# EAGLE design SMDStylophone (EAGLE 5.11)
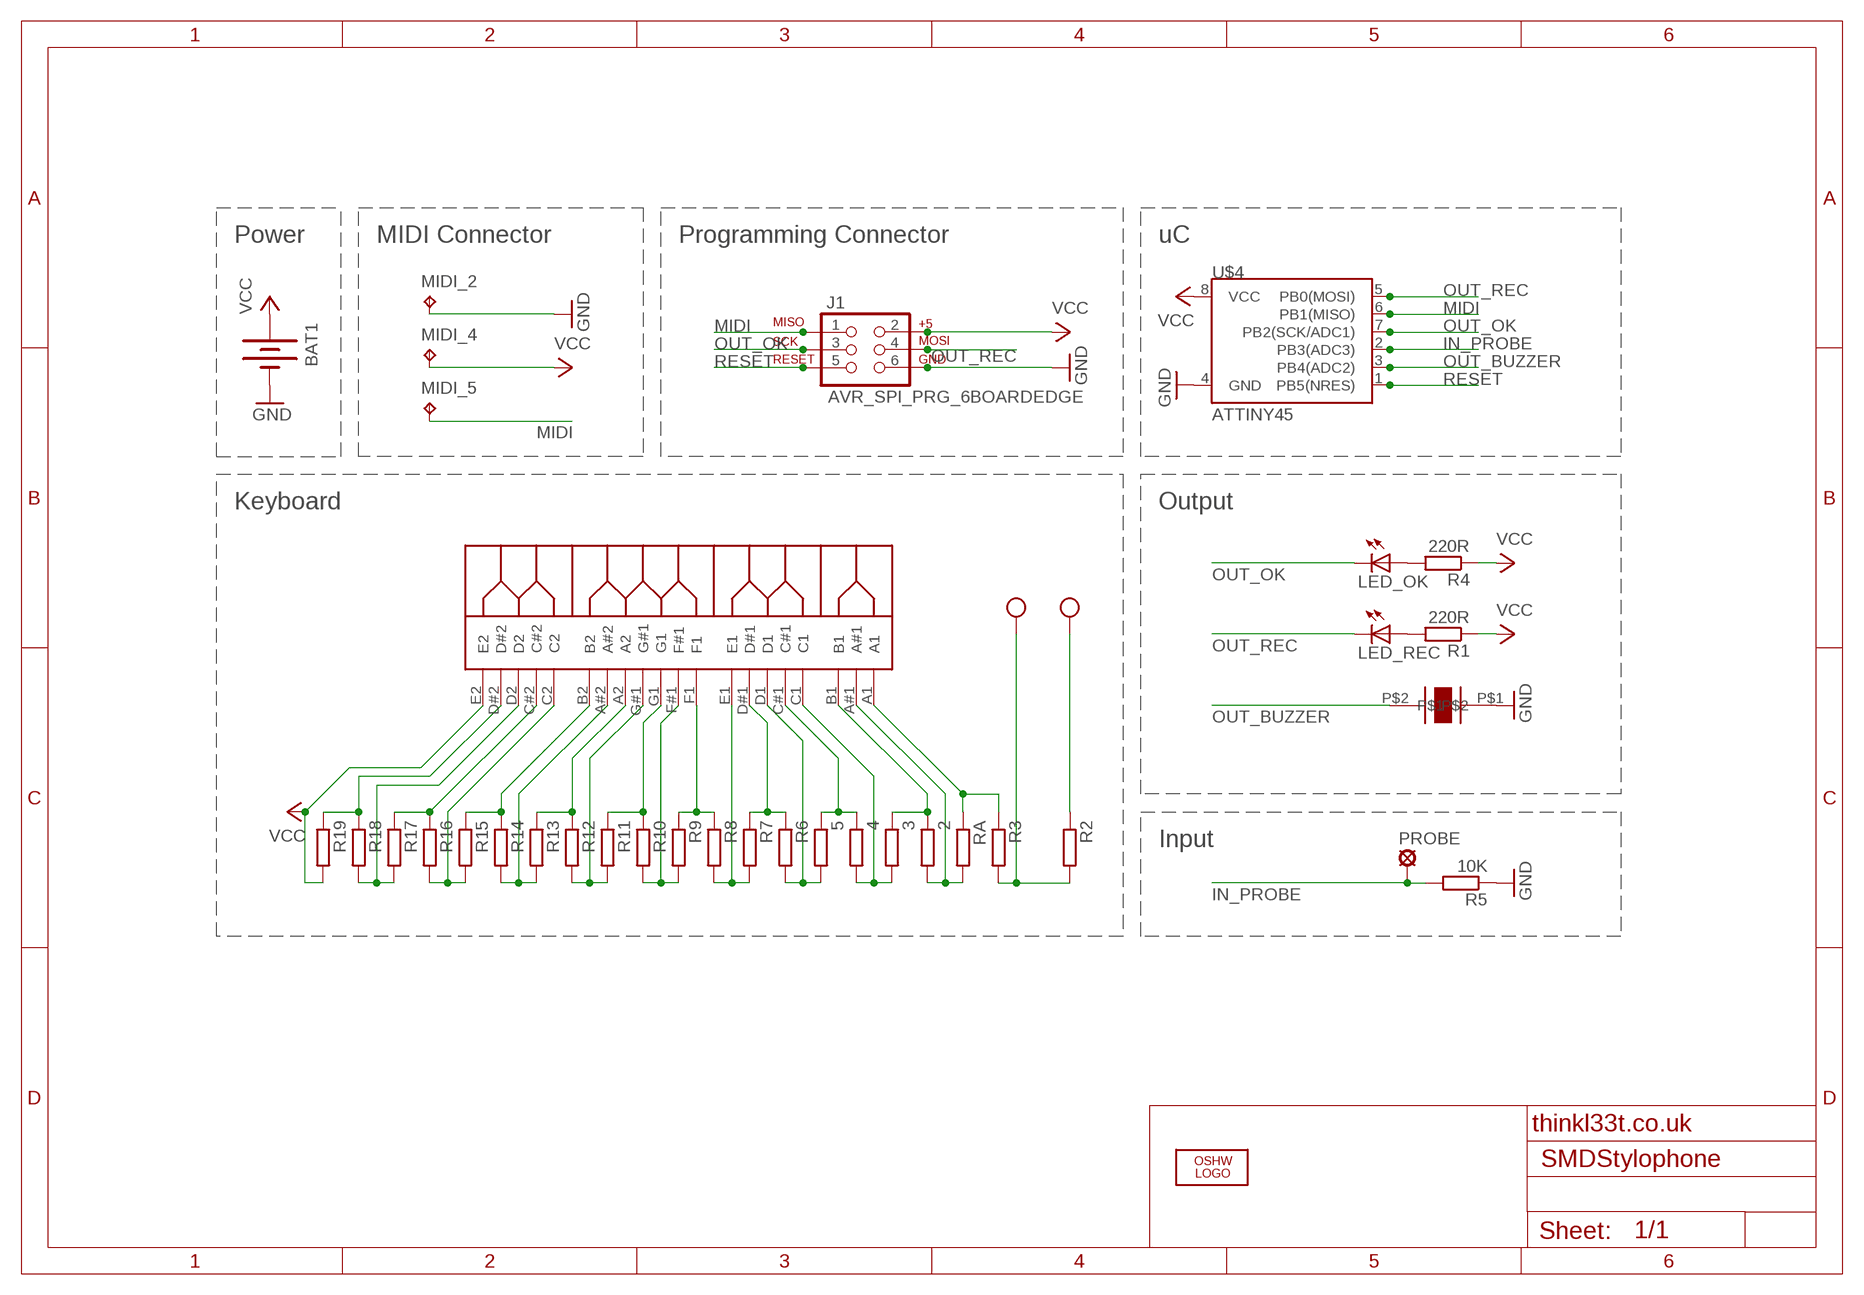
[diagram p0: schematic, sheet 1]

## Parts
2  R-EU_R0805  [R0805]
3  R-EU_R0805  [R0805]
4  R-EU_R0805  [R0805]
5  R-EU_R0805  [R0805]
BAT1  BATTERY20SMD  [BATTCON_20MM]
J1  AVR_SPI_PRG_6BOARDEDGE  [2X3_BOARDEDGE]
LED_OK  LED1206  [LED-1206]
LED_REC  LED1206  [LED-1206]
LOGO1  OSHW_LOGO_6MILX0200-NT  [OSHW_6X200_NOTEXT]
MIDI_2  TPTP20R  [TP20R]
MIDI_4  TPTP20R  [TP20R]
MIDI_5  TPTP20R  [TP20R]
PROBE  LSP10  [LSP10]
R1  220R  R-EU_R0805  [R0805]
R2  R-EU_R0805  [R0805]
R3  R-EU_R0805  [R0805]
R4  220R  R-EU_R0805  [R0805]
R5  10K  R-EU_R0805  [R0805]
R6  R-EU_R0805  [R0805]
R7  R-EU_R0805  [R0805]
R8  R-EU_R0805  [R0805]
R9  R-EU_R0805  [R0805]
R10  R-EU_R0805  [R0805]
R11  R-EU_R0805  [R0805]
R12  R-EU_R0805  [R0805]
R13  R-EU_R0805  [R0805]
R14  R-EU_R0805  [R0805]
R15  R-EU_R0805  [R0805]
R16  R-EU_R0805  [R0805]
R17  R-EU_R0805  [R0805]
R18  R-EU_R0805  [R0805]
R19  R-EU_R0805  [R0805]
RA  R-EU_R0805  [R0805]
U$1  STYLOPHONE  STYLOPHONENANO  [NANO-KEYBOARD]
U$2  PS1420P02AT  [PS1420P02AT]
U$3  KEY  [BUTTON]
U$4  ATTINY45  [SO08-EIAJ]
U$5  KEY  [BUTTON]

## Nets
GND: BAT1.2(-) J1.6 MIDI_2.TP R5.1 U$2.P$1 U$4.4(GND)
IN_PROBE: PROBE.MP R5.2 U$4.2(PB3(ADC3))
MIDI: J1.1 MIDI_5.TP U$4.6(PB1(MISO))
N$1: 2.2 RA.2 U$1.A#1
N$2: 3.2 4.2 U$1.C1
N$3: 5.2 R6.2 U$1.D1
N$4: R7.2 R8.2 U$1.E1
N$5: R9.2 R10.2 U$1.F#1
N$6: R11.2 R12.2 U$1.G#1
N$7: R13.2 R14.2 U$1.A#2
N$8: R15.2 R16.2 U$1.C2
N$9: R17.2 R18.2 U$1.D2
N$10: R18.1 R19.1 U$1.D#2
N$11: R16.1 R17.1 U$1.C#2
N$12: R14.1 R15.1 U$1.B2
N$13: R12.1 R13.1 U$1.A2
N$14: R10.1 R11.1 U$1.G1
N$15: R8.1 R9.1 U$1.F1
N$16: R6.1 R7.1 U$1.D#1
N$17: 4.1 5.1 U$1.C#1
N$18: 2.1 3.1 U$1.B1
N$22: LED_OK.A R4.2
N$23: R3.1 RA.1 U$1.A1
N$24: R2.2 R3.2 U$3.P$1
N$25: R2.1 U$5.P$1
N$27: LED_REC.A R1.2
OUT_BUZZER: U$2.P$2 U$4.3(PB4(ADC2))
OUT_OK: J1.3 LED_OK.C U$4.7(PB2(SCK/ADC1))
OUT_REC: J1.4 LED_REC.C U$4.5(PB0(MOSI))
RESET: J1.5 U$4.1(PB5(NRES))
VCC: BAT1.1(+) J1.2 MIDI_4.TP R1.1 R4.1 R19.2 U$1.E2 U$4.8(VCC)

## Notes on the sheet
- Power | MIDI Connector | Programming Connector | uC
- Keyboard | Output
- Input
- thinkl33t.co.uk

## Library data of the parts
2-5 R1-R19 RA = resistor:R-EU_: RESISTOR, European symbol
BAT1 = SparkFun:BATTERY: Battery Holders Various common sizes : AA, AAA, 20mm coin cell and 12mm coin cell.
J1 = AVR Header:AVR_SPI_PRG_6: AVR ISP 6 Pin This is the reduced ISP connector for AVR programming. Common on Arduino. This footprint will take up less PCB space and can be used with a 10-pin to 6-pin adapter such as SKU: BOB-08508
LED_OK LED_REC = SparkFun:LED: LEDs Standard schematic elements and footprints for 5mm, 3mm, 1206, and 0603 sized LEDs. 5mm - Spark Fun Electronics SKU : COM-00529 (and others)
LOGO1 = OSHW:OSHW_LOGO_6MIL
MIDI_2 MIDI_4 MIDI_5 = testpad:TP: Test pad
PROBE = solpad:LSP10: SOLDER PAD drill 1.0 mm, distributor Buerklin, 12H555
U$1 = stlkb:STYLOPHONE
U$2 = piezo:PS1420P02AT
U$3 U$5 = key:KEY
U$4 = SparkFun:ATTINY45: Atmel ATTiny45

## Board
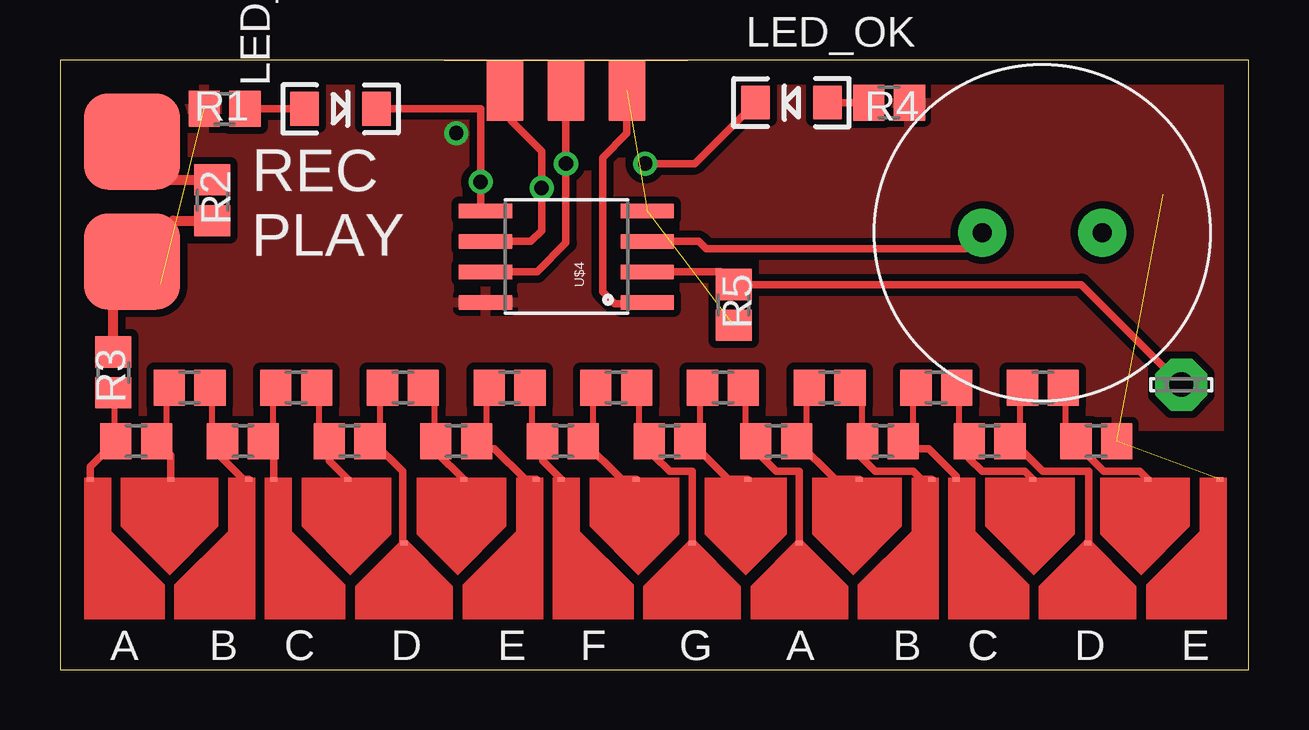
[diagram p1: board, top side]
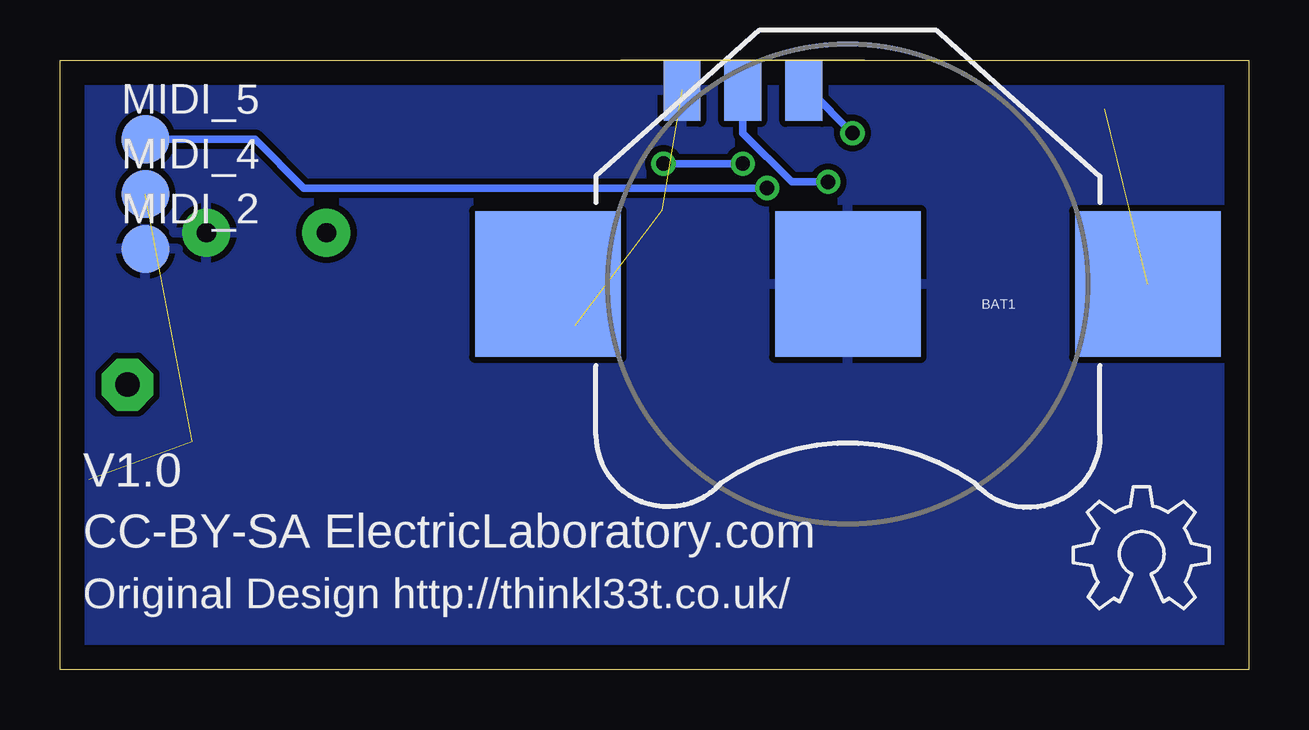
[diagram p2: board, bottom side, seen from below]

Size 49.53 x 25.4 mm. Coordinates in mm from the lower left corner, seen from the top.
Outline: 0,0 49.53,0 49.53,25.4 0,25.4 0,0
Copper layers (1*16): Top 0.035mm / dielectric 1.5mm / Bottom 0.035mm
Design rules "default": minimum track width 10mil, minimum drill 24mil, track to track 8mil, track to pad 8mil, pad to pad 8mil, via to via 8mil, smd to smd 8mil, copper to edge 40mil, drill to drill 8mil, minimum pad ring 10mil, minimum via ring 8mil, stop-mask expansion 4mil, vias tented up to drill 0mil, thermal gap 10mil

### Footprints (pad centres in the part's own frame; a part is rotated, then mirrored left to right if it is on the bottom)
R0805 = smd 1.3 x 1.5: 1 -0.85,0; 2 0.85,0
BATTCON_20MM = smd 6.07 x 6.07: 1 -12.5,0; 2 0,0; 3 12.5,0
2X3_BOARDEDGE = smd 1.524 x 2.54: 1 -2.54,0; 3 0,0; 5 2.54,0 | smd 1.524 x 2.54 bottom: 2 -2.54,0; 4 0,0; 6 2.54,0
LED-1206 = smd 1.2 x 1.4: A -1.5,0; C 1.5,0
TP20R = smd 2 x 2: TP 0,0
LSP10 = drill 1.016 pad 2.159 octagon: MP 0,0
NANO-KEYBOARD = smd 0.305 x 0.152: A1 0.262,-0.076; A2 29.809,-2.718; A#1 3.615,-0.076; A#2 32.298,-0.076; B1 6.866,-0.076; B2 35.321,-0.076; C1 7.898,-0.076; C2 36.353,-0.076; C#1 10.997,-0.076; C#2 39.528,-0.076; D1 13.334,-2.718; D2 41.814,-2.718; D#1 15.823,-0.076; D#2 44.328,-0.076; E1 18.845,-0.076; E2 47.325,-0.076; F1 19.877,-0.076; F#1 23.002,-0.076; G1 25.338,-2.718; G#1 27.65,-0.076
PS1420P02AT = drill 0.8 pad 2 round: P$1 -2.5,0; P$2 2.5,0
BUTTON = smd 4 x 4: P$1 0,0
SO08-EIAJ = smd 0.61 x 2.21: 1 -1.905,-3.378; 2 -0.635,-3.378; 3 0.635,-3.378; 4 1.905,-3.378; 5 1.905,3.353; 6 0.635,3.353; 7 -0.635,3.353; 8 -1.905,3.353

### Placement (x,y rotation side)
2  5.4,11.75 180 top
3  7.62,9.53 0 top
4  9.84,11.75 180 top
5  12.06,9.53 0 top
BAT1  16.7,16.07 180 bottom
J1  21.08,24.13 0 top
LED_OK  30.48,23.62 180 top
LED_REC  11.68,23.37 0 top
LOGO1  7.3,2.54 0 bottom
MIDI_2  45.97,17.53 0 bottom
MIDI_4  45.97,19.81 0 bottom
MIDI_5  45.97,22.1 0 bottom
PROBE  46.72,11.87 0 top
R1  6.86,23.37 0 top
R2  6.35,19.56 270 top
R3  2.22,12.38 90 top
R4  34.54,23.62 180 top
R5  28.07,15.19 90 top
R6  14.29,11.75 180 top
R7  16.51,9.53 0 top
R8  18.73,11.75 180 top
R9  20.95,9.53 0 top
R10  23.18,11.75 180 top
R11  25.4,9.53 0 top
R12  27.62,11.75 180 top
R13  29.84,9.53 0 top
R14  32.07,11.75 180 top
R15  34.29,9.53 0 top
R16  36.51,11.75 180 top
R17  38.73,9.53 0 top
R18  40.96,11.75 180 top
R19  43.18,9.53 0 top
RA  3.17,9.53 0 top
U$1  1,8 0 top
U$2  40.93,18.21 180 top
U$3  3,17 270 top
U$4  21.08,17.21 90 top
U$5  3,22 0 top

### Tracks (layer width: path | path; a pad name or v marks a point on that pad's centre or on a via)
GND  (2 unrouted)
  pour Bottom (isolate 0.254): -1.27,-1.27 50.8,-1.27 50.8,30.48 -1.27,30.48
IN_PROBE
  Top 0.305: U$4.2 27.54,16.57 R5.2 42.55,16.04 PROBE.MP
MIDI  (via drill 0.6)
  Top 0.305: U$4.6 19.62,17.84 20.07,18.29 v20.07,20.07 20.07,21.59 18.8,22.86 18.8,23.88 J1.1
  Bottom 0.305: MIDI_5.TP 41.4,22.1 39.37,20.07 v20.07,20.07
N$1
  Top 0.254: RA.2 4.06,9.53 4.45,9.91 4.45,11.68 2.2
  Top 0.305: U$1.A#1 4.62,8.94 RA.2
N$2
  Top 0.254: 3.2 8.51,9.53 8.89,9.91 8.89,11.68 4.2
  Top 0.305: U$1.C1 8.9,9.1 3.2
N$3
  Top 0.254: 5.2 12.95,9.53 13.34,9.91 13.34,11.68 R6.2
  Top 0.305: 12.95,9.53 13.02,9.53 14.29,8.26 14.29,5.33 U$1.D1
N$4
  Top 0.254: R7.2 17.4,9.53 17.78,9.91 17.78,11.68 R8.2
  Top 0.305: U$1.E1 19.38,7.92 18.1,9.21 17.68,9.21 R7.2
N$5
  Top 0.254: R9.2 21.84,9.53 22.23,9.91 22.23,11.68 R10.2
  Top 0.305: U$1.F#1 23.41,7.92 R9.2
N$6
  Top 0.254: R11.2 26.29,9.53 26.67,9.91 26.67,11.68 R12.2
  Top 0.305: U$1.G#1 27.85,7.92 R11.2
N$7
  Top 0.254: R13.2 30.73,9.53 31.11,9.91 31.11,11.68 R14.2
  Top 0.305: U$1.A#2 32.3,7.92 R13.2
N$8
  Top 0.254: R15.2 35.18,9.53 35.56,9.91 35.56,11.68 R16.2
  Top 0.305: U$1.C2 37.35,8.05 36.2,9.21 35.46,9.21 R15.2
N$9
  Top 0.254: R17.2 39.62,9.53 40.01,9.91 40.01,11.68 R18.2
  Top 0.305: 39.62,9.53 39.69,9.53 40.96,8.26 42.86,8.26 42.86,5.33 U$1.D2
N$10
  Top 0.254: R19.1 42.29,9.53 41.91,9.91 41.91,11.68 R18.1
  Top 0.305: R19.1 42.33,9.42 43.5,8.26 45,8.26 U$1.D#2
N$11
  Top 0.254: R17.1 37.85,9.53 37.47,9.91 37.47,11.68 R16.1
  Top 0.305: R17.1 37.88,8.79 38.42,8.26 40.2,8.26 U$1.C#2
N$12
  Top 0.254: R14.1 33.02,11.68 33.4,11.3 33.4,9.53 R15.1
  Top 0.305: U$1.B2 35.89,7.92 35.56,8.26 33.97,8.26 33.34,8.89 33.34,9.42 R15.1
N$13
  Top 0.254: R13.1 28.96,9.53 28.57,9.91 28.57,11.68 R12.1
  Top 0.305: U$1.A2 30.81,8.24 30.8,8.26 29.84,8.26 29.21,8.89 29.21,9.31 R13.1
N$14
  Top 0.254: R11.1 24.51,9.53 24.13,9.91 24.13,11.68 R10.1
  Top 0.305: U$1.G1 26.34,8.24 26.35,8.26 25.4,8.26 24.77,8.89 24.77,9.31 R11.1
N$15
  Top 0.254: R9.1 20.07,9.53 19.68,9.91 19.68,11.68 R8.1
  Top 0.305: R9.1 20.11,8.7 U$1.F1
N$16
  Top 0.254: R6.1 15.24,11.68 15.62,11.3 15.62,9.53 R7.1
  Top 0.305: R7.1 15.66,9.09 U$1.D#1
N$17
  Top 0.254: 5.1 11.18,9.53 10.79,9.91 10.79,11.68 4.1
  Top 0.305: 5.1 11.21,8.71 U$1.C#1
N$18
  Top 0.254: 3.1 6.73,9.53 6.35,9.91 6.35,11.68 2.1
  Top 0.305: U$1.B1 7.63,7.92 6.67,8.89 6.67,9.42 3.1
N$22
  Top 0.305: LED_OK.A R4.2
N$23
  Top 0.254: R3.1 2.29,11.43 2.29,9.53 RA.1
  Top 0.305: U$1.A1 1.26,8.46 RA.1
N$24
  Top 0.406: R3.2 2.22,16.22 U$3.P$1 4.71,18.71 R2.2
N$25
  Top 0.406: U$5.P$1 4.59,20.41 R2.1
N$27
  Top 0.305: R1.2 LED_REC.A
OUT_BUZZER
  Top 0.305: U$4.3 26.61,17.84 26.92,17.53 37.75,17.53 U$2.P$2
OUT_OK  (via drill 0.6)
  Top 0.305: U$4.7 19.88,16.57 21.08,17.78 v21.08,21.08 J1.3 | LED_OK.C 26.44,21.08 v24.38,21.08
  Bottom 0.305: v21.08,21.08 v24.38,21.08
OUT_REC  (via drill 0.6)
  Top 0.305: LED_REC.C 17.53,23.37 v17.53,20.32 17.53,19.56 17.53,19.32 U$4.5
  Bottom 0.305: v17.53,20.32 19.05,20.32 21.08,22.35 J1.4
RESET
  Top 0.305: J1.5 23.62,22.35 22.61,21.34 22.61,15.75 23.11,15.24 24.4,15.24 U$4.1
VCC  (via drill 0.6)  (3 unrouted)
  Top 0.305: v16.51,22.35 16.76,22.61
  Bottom 0.305: J1.2 18.29,24.13 v16.51,22.35
  pour Top (isolate 0.305): -2.54,31.75 -2.54,10.16 52.32,10.16 52.07,31.75

### Text on the board
tPlace: REC | PLAY
bPlace: V1.0 | CC-BY-SA ElectricLaboratory.com | Original Design http://thinkl33t.co.uk/